# EAGLE design board-ext (EAGLE 7.4.0)
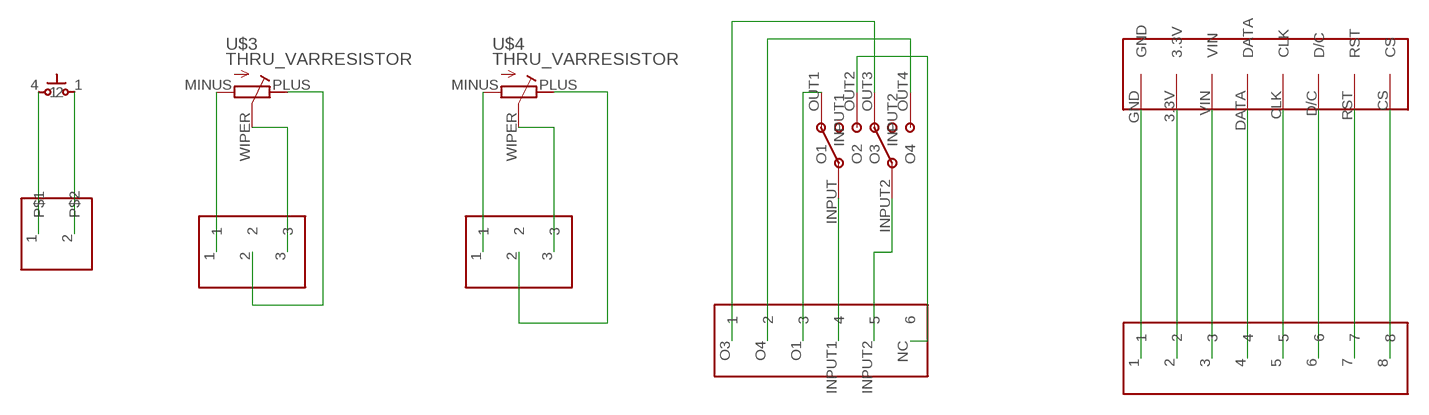
[diagram p0: schematic, sheet 1]

## Parts
U$1  1X02  [1X02]
U$2  BUTTON_THRU  [PUSHBTN]
U$3  THRU_VARRESISTOR  [POT]
U$4  THRU_VARRESISTOR  [POT]
U$5  1X03  [1X03]
U$6  1X03  [1X03]
U$7  SWITCH_THRU  [DPDT]
U$8  1X06  [SWITCHHEAD]
U$9  OLED_THRU  [OLED_THRU]
U$10  1X08  [1X08]

## Nets
N$1: U$1.1 U$2.4
N$2: U$1.2 U$2.1
N$3: U$4.PLUS U$6.2
N$4: U$4.MINUS U$6.1
N$5: U$4.WIPER U$6.3
N$6: U$3.WIPER U$5.3
N$7: U$3.PLUS U$5.2
N$8: U$3.MINUS U$5.1
N$9: U$7.INPUT(INPUT1) U$8.INPUT1
N$10: U$7.INPUT2 U$8.INPUT2
N$11: U$7.OUT2(O2) U$8.NC
N$12: U$7.OUT1(O1) U$8.O1
N$13: U$7.OUT3(O3) U$8.O3
N$14: U$7.OUT4(O4) U$8.O4
N$15: U$9.GND U$10.1
N$16: U$9.3.3V U$10.2
N$17: U$9.VIN U$10.3
N$18: U$9.DATA U$10.4
N$19: U$9.CLK U$10.5
N$20: U$9.D/C U$10.6
N$21: U$9.RST U$10.7
N$22: U$9.CS U$10.8

## Library data of the parts
U$1 = ps-custom:1X02
U$2 = ps-custom:BUTTON_THRU
U$3 U$4 = ps-custom:THRU_VARRESISTOR
U$5 U$6 = ps-custom:1X03
U$7 = ps-custom:SWITCH_THRU
U$8 = ps-custom:1X06
U$9 = ps-custom:OLED_THRU
U$10 = ps-custom:1X08

## Board
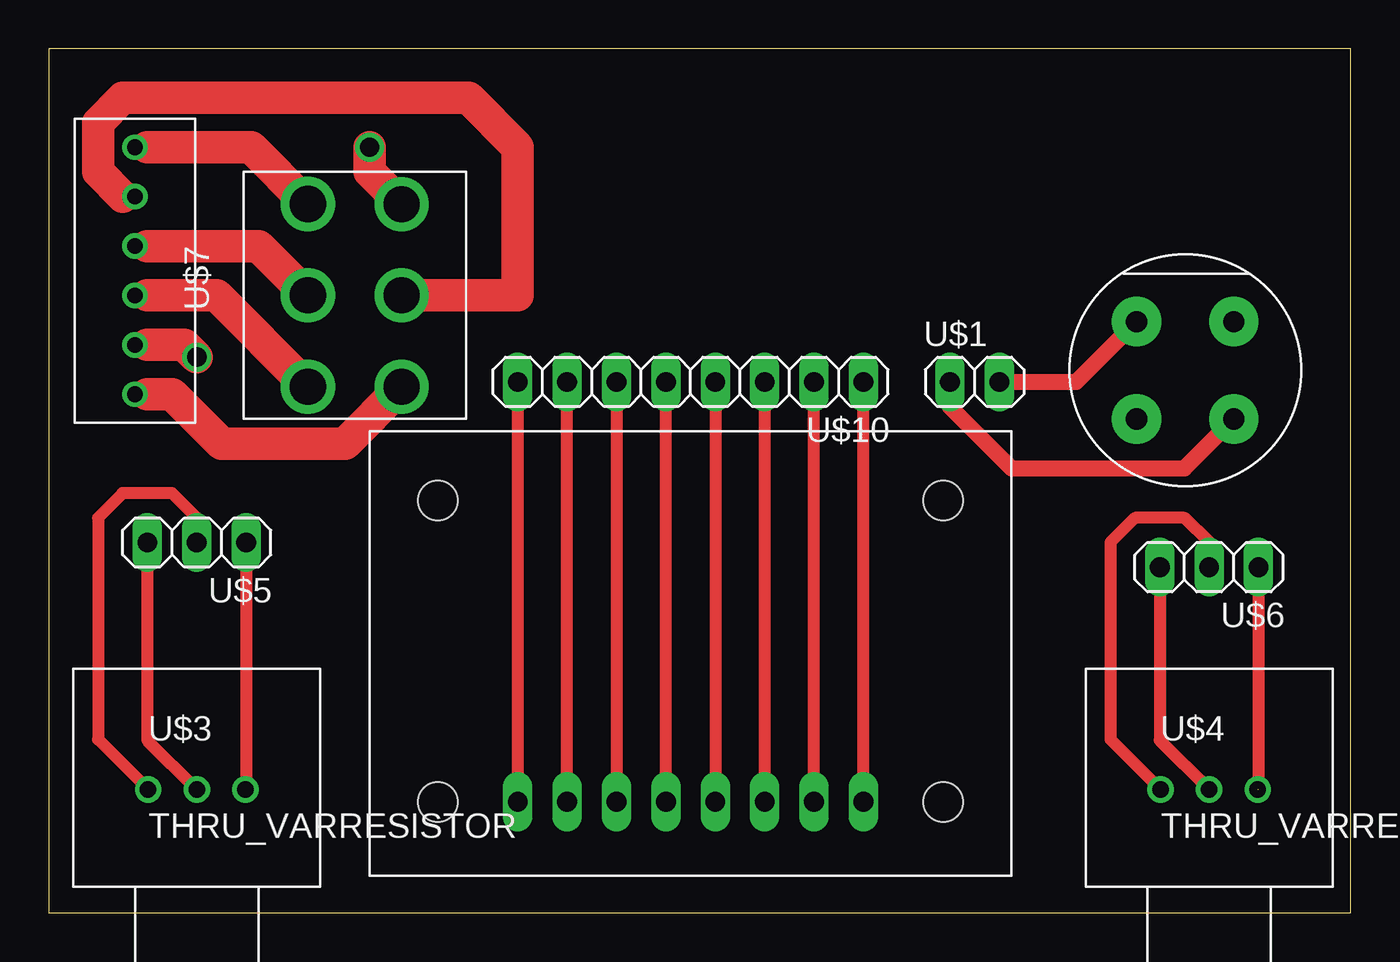
[diagram p1: board, top side]
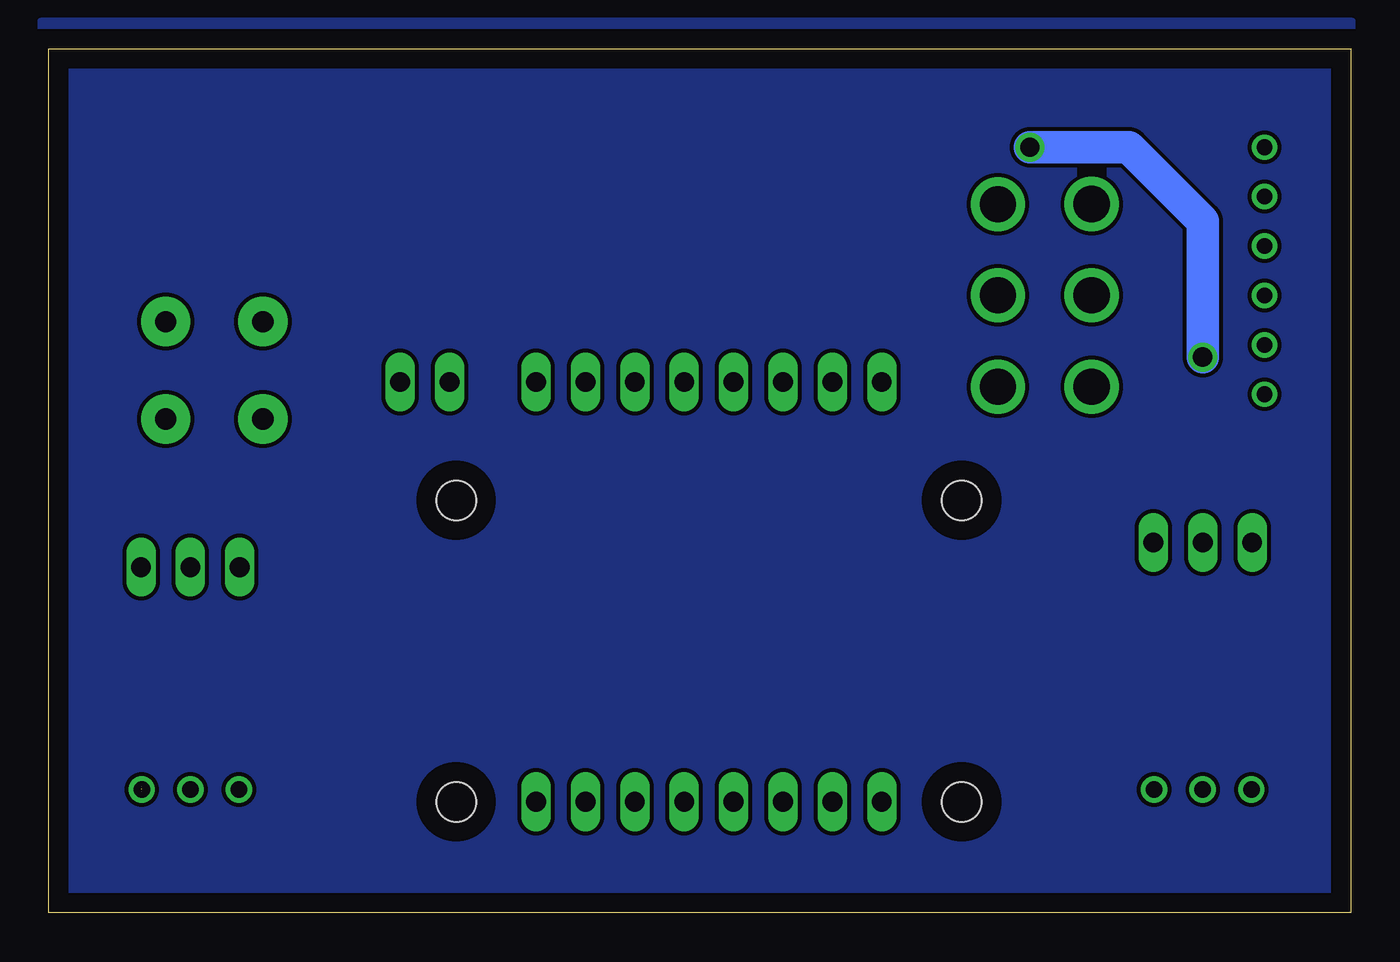
[diagram p2: board, bottom side, seen from below]

Size 66.98 x 44.44 mm. Coordinates in mm from the lower left corner, seen from the top.
Outline: 0,0 66.98,0 66.98,44.44 0,44.44 0,0
Copper layers (1*16): Top 0.035mm / dielectric 1.5mm / Bottom 0.035mm
Design rules "default": minimum track width 10mil, minimum drill 24mil, track to track 8mil, track to pad 8mil, pad to pad 8mil, via to via 8mil, smd to smd 8mil, copper to edge 40mil, drill to drill 8mil, minimum pad ring 10mil, minimum via ring 8mil, stop-mask expansion 4mil, vias tented up to drill 0mil, thermal gap 10mil

### Footprints (pad centres in the part's own frame; a part is rotated, then mirrored left to right if it is on the bottom)
1X02 = drill 1.016 long: 1 -1.27,0; 2 1.27,0
PUSHBTN = drill 1.092 pad 2.54: 1 -5.004,5.004; 2 0,5.004; 3 -5.004,0; 4 0,0
POT = drill 0.85: MINUS 2.5,0; PLUS -2.5,0; WIPER 0,0
1X03 = drill 1.016 long: 1 -2.54,0; 2 0,0; 3 2.54,0
DPDT = drill 1.854: INPUT 0,0; INPUT2 0,4.826; OUT1 4.7,0; OUT2 -4.7,0; OUT3 4.699,4.826; OUT4 -4.699,4.826
SWITCHHEAD = drill 0.8: INPUT1 1.27,0; INPUT2 3.81,0; NC 6.35,0; O1 -1.27,0; O3 -6.35,0; O4 -3.81,0
OLED_THRU = drill 1.016 long: 3.3V 6.35,0; CLK -1.27,0; CS -8.89,0; D/C -3.81,0; DATA 1.27,0; GND 8.89,0; RST -6.35,0; VIN 3.81,0 | hole 2.032: -13,0; 13,0; -13,15.5; 13,15.5
1X08 = drill 1.016 long: 1 -8.89,0; 2 -6.35,0; 3 -3.81,0; 4 -1.27,0; 5 1.27,0; 6 3.81,0; 7 6.35,0; 8 8.89,0

### Placement (x,y rotation side)
U$1  47.62,27.3 0 top
U$2  60.96,25.4 0 top
U$3  7.62,6.35 0 top
U$4  59.69,6.35 0 top
U$5  7.62,19.05 180 top
U$6  59.69,17.78 180 top
U$7  13.33,31.75 270 top
U$8  4.45,33.02 90 top
U$9  33.02,5.71 0 top
U$10  33.02,27.3 180 top

### Tracks (layer width: path | path; a pad name or v marks a point on that pad's centre or on a via)
GND
  pour Bottom: 0,45.72 67.31,45.72 67.31,0 0,0
N$1
  Top 0.813: U$1.1 46.36,26.04 49.53,22.86 58.42,22.86 U$2.4
N$2
  Top 0.813: U$1.2 52.86,27.3 U$2.1
N$3
  Top 0.61: U$6.2 59.69,19.05 58.42,20.32 55.88,20.32 54.61,19.05 54.61,8.93 U$4.PLUS
N$4  (1 unrouted)
  Top 0.61: U$6.1 62.23,6.35
N$5
  Top 0.61: U$4.WIPER 57.15,8.89 U$6.3
N$6
  Top 0.61: U$5.3 5.08,8.89 U$3.WIPER
N$7
  Top 0.61: U$5.2 7.62,20.32 6.35,21.59 3.81,21.59 2.54,20.32 2.54,8.93 U$3.PLUS
N$8
  Top 0.61: U$5.1 10.16,6.39 U$3.MINUS
N$9
  Top 0.406: U$8.INPUT1 5.08,34.29
  Top 1.676: 5.08,34.29 10.79,34.29 U$7.INPUT
N$10
  Top 0.406: U$8.INPUT2 3.81,36.83
  Top 1.676: 3.81,36.83 2.54,38.1 2.54,40.64 3.81,41.91 21.59,41.91 24.13,39.37 24.13,31.75 U$7.INPUT2
N$11
  Top 0.406: U$8.NC 5.08,39.37
  Top 1.676: 5.08,39.37 10.41,39.37 U$7.OUT2
N$12
  Top 0.61: U$8.O1 5.08,31.75
  Top 1.676: 5.08,31.75 8.63,31.75 U$7.OUT1
N$13
  Top 0.406: U$8.O3 5.08,26.67
  Top 1.676: 5.08,26.67 6.35,26.67 8.89,24.13 15.24,24.13 U$7.OUT3
N$14  (via drill 1)
  Top 0.61: U$8.O4 5.08,29.21
  Top 1.676: 5.08,29.21 6.98,29.21 v7.62,28.57 | v16.51,39.37 16.51,38.1 U$7.OUT4
  Bottom 1.676: v7.62,28.57 7.62,35.56 11.43,39.37 v16.51,39.37
N$15
  Top 0.61: U$9.GND U$10.1
N$16
  Top 0.61: U$9.3.3V U$10.2
N$17
  Top 0.61: U$10.3 U$9.VIN
N$18
  Top 0.61: U$10.4 U$9.DATA
N$19
  Top 0.61: U$9.CLK U$10.5
N$20
  Top 0.61: U$10.6 U$9.D/C
N$21
  Top 0.61: U$9.RST U$10.7
N$22
  Top 0.61: U$10.8 U$9.CS